# EAGLE schematic One side4 (EAGLE 9.6.1)
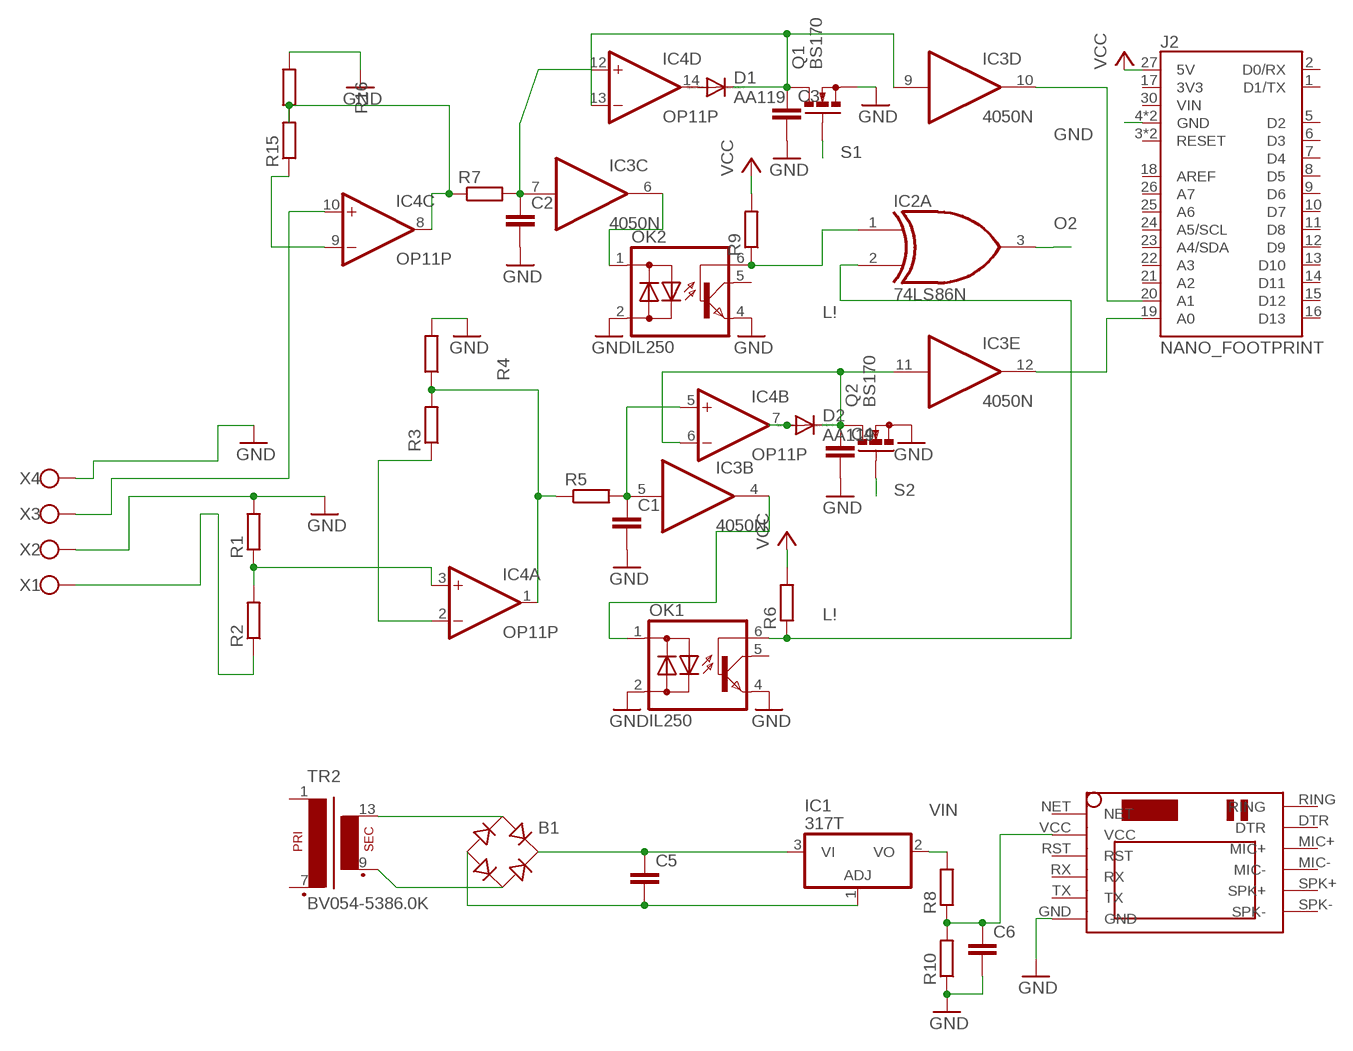
[diagram p0: schematic, sheet 1]

## Parts
B1  B-DIL  [B-DIL]
C1  C15/9  [C15B9]
C2  C15/9  [C15B9]
C3  C15/9  [C15B9]
C4  C15/9  [C15B9]
C5  C15/9  [C15B9]
C6  C15/9  [C15B9]
D1  AA119  [DO07]
D2  AA119  [DO07]
IC1  317T  [TO220H]
IC2  74LS86N  [DIL14]
IC3  4050N  [DIL16]
IC4  OP11P  [DIL14]
J2  NANO_FOOTPRINT  [NANO]
OK1  IL250  [DIL06]
OK2  IL250  [DIL06]
Q1  BS170  [SOT54E]
Q2  BS170  [SOT54E]
R1  R-EU_0617/22  [0617/22]
R2  R-EU_0617/22  [0617/22]
R3  R-EU_0617/22  [0617/22]
R4  R-EU_0617/22  [0617/22]
R5  R-EU_0617/22  [0617/22]
R6  R-EU_0617/22  [0617/22]
R7  R-EU_0617/22  [0617/22]
R8  R-EU_0617/22  [0617/22]
R9  R-EU_0617/22  [0617/22]
R10  R-EU_0617/22  [0617/22]
R15  R-EU_0617/22  [0617/22]
R16  R-EU_0617/22  [0617/22]
TR2  BV054-5386.0K  [EI54-18,8_16VA]
U$1  SIM800LMODULE  [SIM800LMODULE]
X1  W237-112  [W237-112]
X2  W237-112  [W237-112]
X3  W237-112  [W237-112]
X4  W237-112  [W237-112]

## Nets
GND: C1.2 C2.2 C3.2 C4.2 C6.2 J2.4(GND) J2.29(GND) OK1.2(AC2) OK1.4(E) OK2.2(AC2) OK2.4(E) Q1.S Q2.S R1.2 R4.2 R10.1 R16.2 U$1.GND X2.1(KL) X4.1(KL)
L!: IC2.2(A:I1) OK1.6(B) R6.1
N$1: IC4.3(A:+IN) R1.1 R2.2
N$2: C1.1 IC3.5(B:I) IC4.5(B:+IN) R5.2
N$3: R2.1 X1.1(KL)
N$4: IC4.2(A:-IN) R3.1
N$5: IC4.1(A:OUT) R3.2 R4.1 R5.1
N$6: IC3.4(B:O) OK1.1(AC1)
N$7: IC4.8(C:OUT) R7.1 R15.2 R16.1
N$8: IC4.9(C:-IN) R15.1
N$9: IC4.10(C:+IN) X3.1(KL)
N$10: C6.1 R8.1 R10.2 U$1.VCC
N$11: C2.1 IC3.7(C:I) IC4.12(D:+IN) R7.2
N$12: IC2.1(A:I0) OK2.6(B) R9.1
N$13: IC3.6(C:O) OK2.1(AC1)
N$14: D1.A IC4.14(D:OUT)
N$15: C3.1 D1.C IC3.9(D:I) IC4.13(D:-IN) Q1.D
N$16: D2.A IC4.7(B:OUT)
N$17: C4.1 D2.C IC3.11(E:I) IC4.6(B:-IN) Q2.D
N$18: IC3.10(D:O) J2.20(A1)
N$19: IC3.12(E:O) J2.19(A0)
N$20: B1.AC1 TR2.13(S4)
N$21: B1.AC2 TR2.9(S3)
N$22: B1.+ C5.1 IC1.3(VI)
N$23: B1.- C5.2 IC1.1(ADJ)
O2: IC2.3(A:O)
S1: Q1.G
S2: Q2.G
VCC: J2.27(5V) R6.2 R9.2
VIN: IC1.2(VO) R8.2
Unconnected: IC2.4(B:I0) IC2.5(B:I1) IC2.6(B:O) IC2.8(C:O) IC2.9(C:I0) IC2.10(C:I1) IC2.11(D:O) IC2.12(D:I0) IC2.13(D:I1) IC3.2(A:O) IC3.3(A:I) IC3.14(F:I) IC3.15(F:O) J2.1(D1/TX) J2.2(D0/RX) J2.3(RESET) J2.5(D2) J2.6(D3) J2.7(D4) J2.8(D5) J2.9(D6) J2.10(D7) J2.11(D8) J2.12(D9) J2.13(D10) J2.14(D11) J2.15(D12) J2.16(D13) J2.17(3V3) J2.18(AREF) J2.21(A2) J2.22(A3) J2.23(A4/SDA) J2.24(A5/SCL) J2.25(A6) J2.26(A7) J2.28(RESET) J2.30(VIN) OK1.5(C) OK2.5(C) TR2.1 TR2.7(P2) U$1.DTR U$1.MIC+ U$1.MIC- U$1.NET U$1.RING U$1.RST U$1.RX U$1.SPK+ U$1.SPK- U$1.TX

## Power pins joined to a net without a drawn wire
GND: IC2.7(P:GND)
V+: IC4.4(P:V+)
V-: IC4.11(P:V-)
VCC: IC2.14(P:VCC)
VDD: IC3.1(P:VDD)
VSS: IC3.8(P:VSS)

## Library data of the parts
B1 = rectifier:B-DIL: RECTIFIER
C1-C6 = capacitor-wima:C: CAPACITOR naming: grid - package width
D1 D2 = diode:AA119: DIODE germanium
IC1 = linear:*317: Positive VOLTAGE REGULATOR
IC2 = 74xx-us:74*86: Quad 2-input EXCLUSIV-OR (XOR) gate
IC3 = 40xx:4050: Hex non-inverting BUFFER
IC4 = linear:OP11: Quad Low-Offset Low-Power OP AMP The OP-11 is pin compatible with the OP-400 , LM148, HA4741, RM4156, and LT1014 operational amplifiers source http://products.analog.com/products/info.asp?product=OP400
J2 = SparkFun-Boards:NANO_FOOTPRINT: Generic Nano Footprint
OK1 OK2 = optocoupler:IL250: SIEMENS OPTO COUPLER; MF: VISHAY/TELEFUNKEN; MPN: IL250; OC_FARNELL: 1469559; OC_NEWARK: 58K1705
Q1 Q2 = transistor-small-signal:BS170: N-CHANNEL MOS FET
R1-R10 R15 R16 = rcl:R-EU_: RESISTOR, European symbol
TR2 = trafo:BV054*: ERA EI 54/18,8 16 VA Distributor: RS-Component RS 207-5523 230V / 9V RS 207-9727 230V - 12V RS 207-5551 230V - 15V RS 207-5539 230V - 18V RS 207-5567 230V - 24V Source: 207-5567.pdf
U$1 = SIM800LMODULE:SIM800LMODULE: SIM800L Module
X1-X4 = con-wago-500:W237-112: WAGO SCREW CLAMP; MPN: 237-112; OC_FARNELL: unknown; OC_NEWARK: 76R2974

## Net classes
0 default: width 1.524 mm, drill 0.178 mm, clearance 0.254 mm